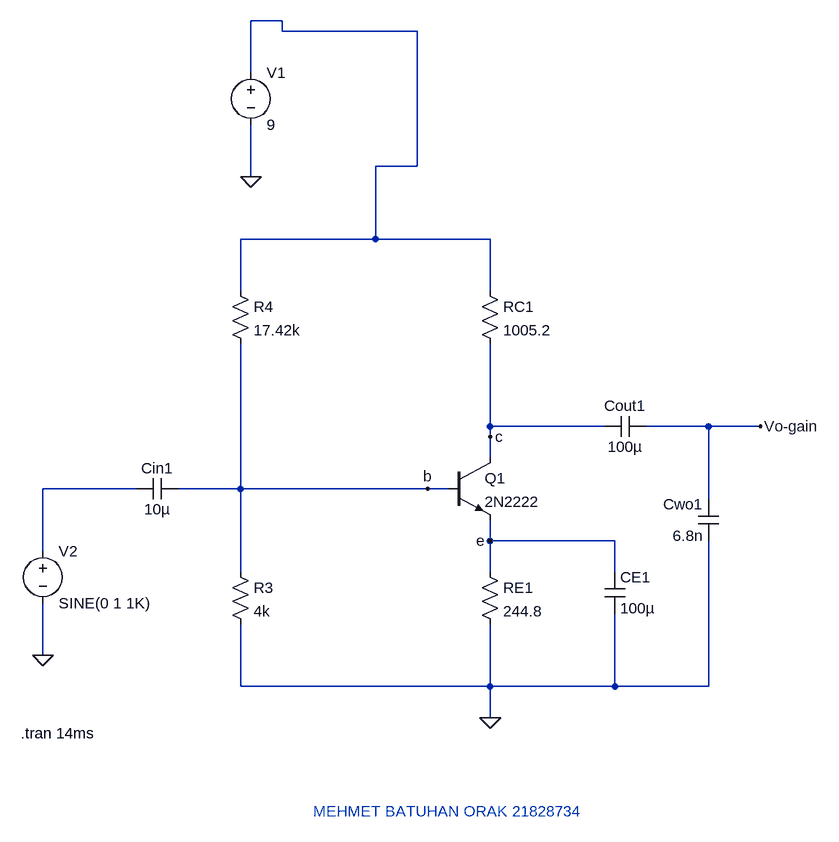
[diagram p0: schematic 3-gain_stage.asc]
3-gain_stage.asc, the LTspice schematic file:
Version 4
SHEET 1 2872 680
WIRE 1056 -832 1008 -832
WIRE 1056 -816 1056 -832
WIRE 1264 -816 1056 -816
WIRE 1008 -752 1008 -832
WIRE 1264 -608 1264 -816
WIRE 1264 -608 1200 -608
WIRE 1008 -592 1008 -672
WIRE 1200 -496 1200 -608
WIRE 1200 -496 992 -496
WIRE 1376 -496 1200 -496
WIRE 992 -416 992 -496
WIRE 1376 -416 1376 -496
WIRE 1376 -208 1376 -336
WIRE 1552 -208 1376 -208
WIRE 1712 -208 1616 -208
WIRE 1792 -208 1712 -208
WIRE 1376 -192 1376 -208
WIRE 1376 -160 1376 -192
WIRE 832 -112 688 -112
WIRE 992 -112 992 -336
WIRE 992 -112 896 -112
WIRE 1280 -112 992 -112
WIRE 1312 -112 1280 -112
WIRE 1712 -96 1712 -208
WIRE 1376 -32 1376 -64
WIRE 1568 -32 1376 -32
WIRE 688 -16 688 -112
WIRE 992 16 992 -112
WIRE 1376 16 1376 -32
WIRE 1568 16 1568 -32
WIRE 688 144 688 64
WIRE 992 192 992 96
WIRE 1376 192 1376 96
WIRE 1376 192 992 192
WIRE 1568 192 1568 80
WIRE 1568 192 1376 192
WIRE 1712 192 1712 -32
WIRE 1712 192 1568 192
WIRE 1376 240 1376 192
FLAG 1376 240 0
FLAG 1376 -192 c
FLAG 1280 -112 b
FLAG 1376 -32 e
FLAG 1792 -208 Vo-gain
FLAG 1008 -592 0
FLAG 688 144 0
SYMBOL res 976 0 R0
SYMATTR InstName R3
SYMATTR Value 4k
SYMBOL res 1360 -432 R0
SYMATTR InstName RC1
SYMATTR Value 1005.2
SYMBOL res 976 -432 R0
SYMATTR InstName R4
SYMATTR Value 17.42k
SYMBOL cap 896 -128 R90
WINDOW 0 0 32 VBottom 2
WINDOW 3 32 32 VTop 2
SYMATTR InstName Cin1
SYMATTR Value 10µ
SYMBOL res 1360 0 R0
SYMATTR InstName RE1
SYMATTR Value 244.8
SYMBOL npn 1312 -160 R0
SYMATTR InstName Q1
SYMATTR Value 2N2222
SYMBOL cap 1616 -224 R90
WINDOW 0 0 32 VBottom 2
WINDOW 3 32 32 VTop 2
SYMATTR InstName Cout1
SYMATTR Value 100µ
SYMBOL cap 1552 16 R0
SYMATTR InstName CE1
SYMATTR Value 100µ
SYMBOL cap 1728 -32 R180
WINDOW 0 24 56 Left 2
WINDOW 3 24 8 Left 2
SYMATTR InstName Cwo1
SYMATTR Value 6.8n
SYMBOL voltage 1008 -768 R0
WINDOW 123 0 0 Left 0
WINDOW 39 0 0 Left 0
SYMATTR InstName V1
SYMATTR Value 9
SYMBOL voltage 688 -32 R0
WINDOW 123 0 0 Left 0
WINDOW 39 0 0 Left 0
SYMATTR InstName V2
SYMATTR Value SINE(0 1 1K)
TEXT 654 264 Left 2 !.tran 14ms
TEXT 1104 384 Left 2 ;MEHMET BATUHAN ORAK 21828734

The netlist it stands for:
* 3-gain_stage.asc
R3 b 0 4k
RC1 N001 c 1005.2
R4 N001 b 17.42k
Cin1 b N002 10µ
RE1 e 0 244.8
Q1 c b e 0 2N2222
Cout1 Vo-gain c 100µ
CE1 e 0 100µ
Cwo1 0 Vo-gain 6.8n
V1 N001 0 9
V2 N002 0 SINE(0 1 1K)
.model NPN NPN
.model PNP PNP
.lib standard.bjt
.tran 14ms
* MEHMET BATUHAN ORAK 21828734
.backanno
.end